# EAGLE design ELE-T203 (EAGLE 4.11)
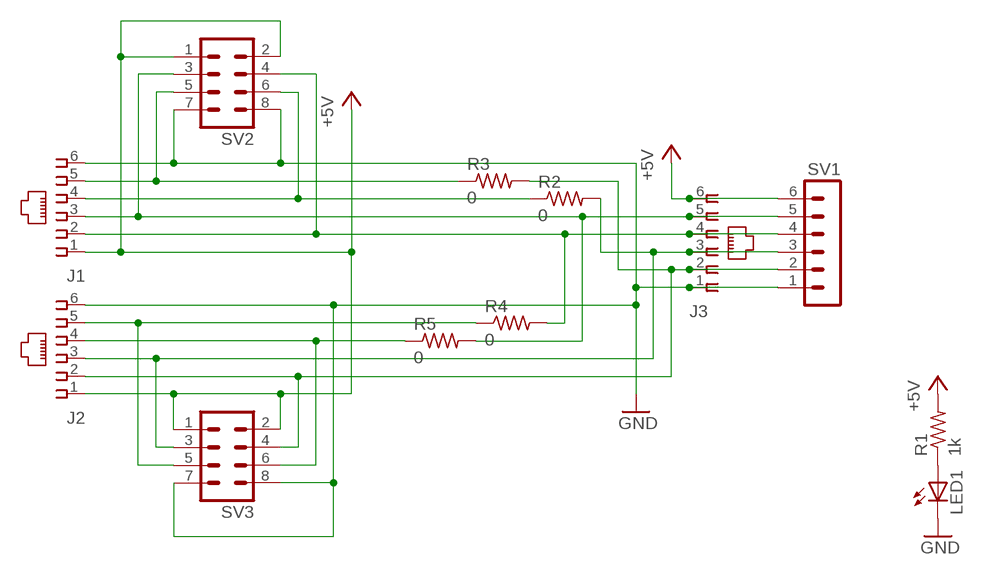
[diagram p0: schematic, sheet 1]

## Parts
J1  TELEPHONE_JACK  [TELEPHONE_JACK]
J2  TELEPHONE_JACK  [TELEPHONE_JACK]
J3  TELEPHONE_JACK  [TELEPHONE_JACK]
LED1  LEDCHIPLED_1206  [CHIPLED_1206]
R1  1k  R-US_R0603  [R0603]
R2  0  R-US_R0603  [R0603]
R3  0  R-US_R0603  [R0603]
R4  0  R-US_R0603  [R0603]
R5  0  R-US_R0603  [R0603]
SV1  MA06-1  [MA06-1]
SV2  MA04-2  [MA04-2]
SV3  MA04-2  [MA04-2]

## Nets
+5V: J1.1 J2.1 J3.6 R1.2 SV1.6 SV2.1 SV2.2 SV3.1 SV3.2
GND: J1.6 J2.6 J3.1 LED1.C SV1.1 SV2.7 SV2.8 SV3.7 SV3.8
N$3: J2.2 J3.2 R3.2 SV1.2 SV3.4
N$4: J2.3 J3.3 R2.2 SV1.3 SV3.3
N$5: J1.2 J3.4 R4.2 SV1.4 SV2.4
N$6: J1.3 J3.5 R5.2 SV1.5 SV2.3
N$7: LED1.A R1.1
N$25: J2.4 R5.1 SV3.6
N$26: J1.4 R2.1 SV2.6
N$27: J1.5 R3.1 SV2.5
N$28: J2.5 R4.1 SV3.5

## Library data of the parts
J1-J3 = TEABOX-LIB:TELEPHONE_JACK: AMP connector
LED1 = led:LED: LED OSRAM: - CHIPLED LG R971, LG N971, LY N971, LG Q971, LY Q971, LO R971, LY R971 LH N974, LH R974 LS Q976, LO Q976, LY Q976 LO Q996 - Hyper CHIPLED LW Q18S LB Q993, LB Q99A, LB R99A - SideLED LS A670, LO A670, LY A670, LG A670, LP A670 LB A673, LV A673, LT A673, LW A673 LH A674 LY A675 LS A676, LA A676, LO A676, LY A676, LW A676 LS A679, LY A679, LG A679 - Hyper Micro SIDELED® LS Y876, LA Y876, LO Y876, LY Y876 LT Y87S - SmartLED LW L88C, LW L88S LB L89C, LB L89S, LG L890 LS L89K, LO L89K, LY L89K LS L896, LA L896, LO L896, LY L896 - TOPLED LS T670, LO T670, LY T670, LG T670, LP T670 LSG T670, LSP T670, LSY T670, LOP T670, LYG T670 LG T671, LOG T671, LSG T671 LB T673, LV T673, LT T673, LW T673 LH T674 LS T676, LA T676, LO T676, LY T676, LB T676, LH T676, LSB T676, LW T676 LB T67C, LV T67C, LT T67C, LS T67K, LO T67K, LY T67K, LW E67C LS E67B, LA E67B, LO E67B, LY E67B, LB E67C, LV E67C, LT E67C LW T67C LS T679, LY T679, LG T679 LS T770, LO T770, LY T770, LG T770, LP T770 LB T773, LV T773, LT T773, LW T773 LH T774 LS E675, LA E675, LY E675, LS T675 LS T776, LA T776, LO T776, LY T776, LB T776 LHGB T686 LT T68C, LB T68C - Hyper Mini TOPLED® LB M676 - Mini TOPLED Santana® LG M470 LS M47K, LO M47K, LY M47K Source: http://www.osram.convergy.de/
R1-R5 = rcl:R-US_: RESISTOR, American symbol
SV1 = con-lstb:MA06-1: PIN HEADER
SV2 SV3 = con-lstb:MA04-2: PIN HEADER

## Board
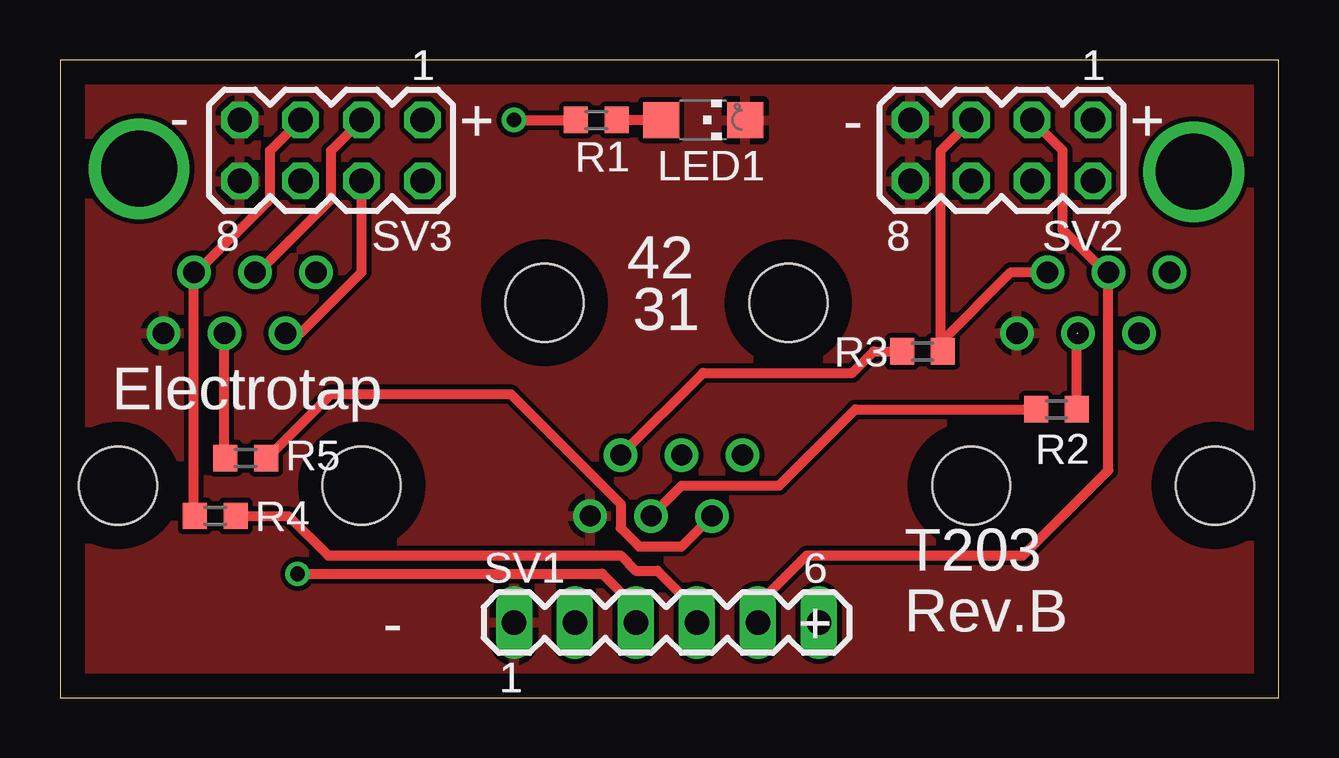
[diagram p1: board, top side]
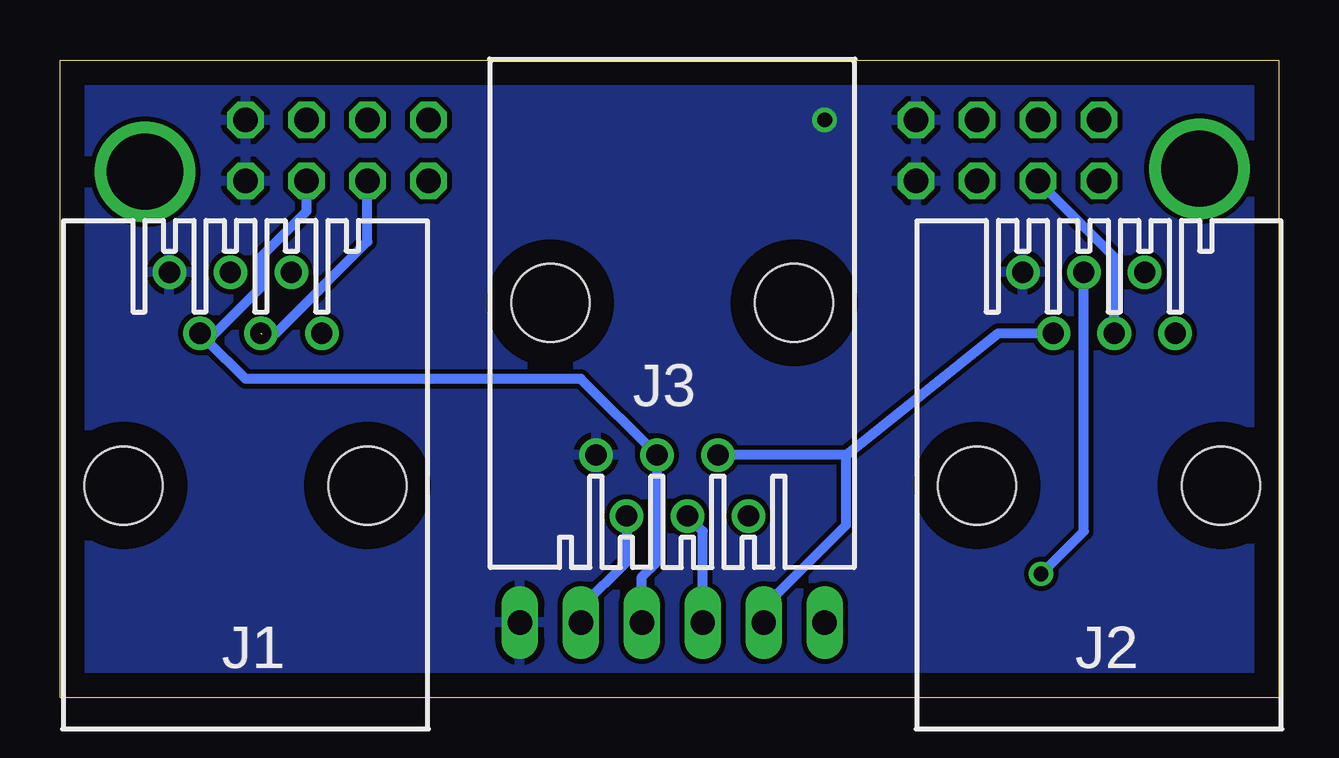
[diagram p2: board, bottom side, seen from below]

Size 50.78 x 26.59 mm. Coordinates in mm from the lower left corner, seen from the top.
Outline: 0,0 50.78,0 50.78,26.59 0,26.59 0,0
Copper layers (1*16): Top 0.035mm / dielectric 1.5mm / Bottom 0.035mm
Design rules "default": minimum track width 10mil, minimum drill 24mil, track to track 8mil, track to pad 8mil, pad to pad 8mil, via to via 8mil, smd to smd 8mil, copper to edge 40mil, drill to drill 8mil, minimum pad ring 10mil, minimum via ring 8mil, stop-mask expansion 4mil, vias tented up to drill 0mil, thermal gap 10mil

### Footprints (pad centres in the part's own frame; a part is rotated, then mirrored left to right if it is on the bottom)
TELEPHONE_JACK = drill 0.889 round: 1 -3.175,8.89; 2 -1.905,6.35; 3 -0.635,8.89; 4 0.635,6.35; 5 1.905,8.89; 6 3.175,6.35 | hole 3.251: -5.08,0; 5.08,0
CHIPLED_1206 = smd 1.5 x 1.5: A 0,-1.75; C 0,1.75
R0603 = smd 1 x 1.1: 1 -0.85,0; 2 0.85,0
MA06-1 = drill 1.016 long: 1 -6.35,0; 2 -3.81,0; 3 -1.27,0; 4 1.27,0; 5 3.81,0; 6 6.35,0
MA04-2 = drill 1.016 octagon: 1 -3.81,-1.27; 2 -3.81,1.27; 3 -1.27,-1.27; 4 -1.27,1.27; 5 1.27,-1.27; 6 1.27,1.27; 7 3.81,-1.27; 8 3.81,1.27

### Placement (x,y rotation side)
J1  43.05,8.85 0 bottom
J2  7.49,8.85 0 bottom
J3  25.27,16.47 180 bottom
LED1  26.79,24.09 270 top
R1  22.35,24.09 180 top
R2  41.52,12.03 180 top
R3  35.94,14.44 180 top
R4  6.47,7.58 0 top
R5  7.74,9.99 0 top
SV1  25.27,3.14 0 top
SV2  39.24,22.82 180 top
SV3  11.3,22.82 180 top

### Tracks (layer width: path | path; a pad name or v marks a point on that pad's centre or on a via)
+5V  (via drill 0.61)
  Top 0.406: v18.92,24.09 R1.2
  pour Bottom: -0.13,26.63 50.67,26.63 50.67,-0.04 -0.13,-0.04
GND
  pour Top: -0.13,26.63 50.67,26.63 50.67,-0.04 -0.13,-0.04
N$1  (via drill 3.17)
  other vias: 3.3,22.06
N$2  (via drill 3.17)
  other vias: 47.24,21.93
N$3
  Top 0.406: R3.2 33.9,14.44 33.02,13.55 26.79,13.55 J3.2 | SV3.4 12.57,17.74 10.03,15.2 J2.2
  Bottom 0.406: 18.03,10.12 J3.2 | 18.03,10.12 18.03,7.2 21.46,3.77 SV1.2 | J2.2 11.68,15.2 18.03,10.12
N$4  (via drill 0.61)
  Top 0.406: R2.2 33.14,12.03 29.97,8.85 25.9,8.85 J3.3 | v9.9,5.17 22.6,5.17 24,3.77 SV1.3 | SV3.3 11.3,22.82 11.3,20.79 8.25,17.74 J2.3
  Bottom 0.406: J3.3 24,6.95 SV1.3 | J2.3 8.12,6.95 v9.9,5.17
N$5
  Top 0.406: R4.2 9.52,7.58 11.17,5.93 23.36,5.93 24,5.3 24.89,5.3 26.41,3.77 26.54,3.77 SV1.4 26.54,3.01
  Bottom 0.406: SV1.4 26.54,5.04 25.9,5.68 J3.4 29.08,13.3 43.05,13.3 44.64,14.88 | 44.64,14.88 J1.2 | SV2.4 40.51,20.28 42.41,18.38 42.41,17.11 44.64,14.88
N$6
  Top 0.406: SV1.5 29.2,3.26 29.2,4.03 31.11,5.93 40.13,5.93 43.68,9.49 J1.3 43.56,17.74 41.78,19.52 41.78,22.82 SV2.3 | R5.2 8.63,9.99 11.3,12.66 18.79,12.66 23.36,8.09 23.36,7.07 24.12,6.31 25.9,6.31 J3.5
  Bottom 0.406: J3.5 27.17,5.68 29.08,3.77 SV1.5
N$7
  Top 0.406: LED1.A R1.1
N$25
  Top 0.406: R5.1 6.85,9.99 J2.4
  Bottom 0.406: SV3.6 6.85,18.38 J2.4
N$26  (1 unrouted)
  Top 0.406: 42.41,12.03 R2.1 42.37,15.16
  Bottom 0.406: SV2.6 37.97,19.01 41.78,15.2 J1.4
N$27
  Top 0.406: R3.1 36.7,14.44 | J1.5 39.62,17.74 36.7,14.82 36.7,14.44 | SV2.5 36.7,22.82 36.7,14.44
N$28
  Top 0.406: SV3.5 8.76,22.82 8.76,20.79 5.58,17.61 J2.5 5.58,7.58 R4.1

### Text on the board
tPlace: - | + | - | + | 42 | 31 | Electrotap | T203 | Rev.B | - | +
_tplace: 1 | 1 | - | + | R1 | - | + | LED1 | 8 | SV3 | 8 | SV2 | 42 | 31 | R3 | Electrotap | R2 | R5 | R4 | SV1 | 6 | T203 | Rev.B | - | + | 1
_bplace: J3 | J2 | J1